# EAGLE schematic ControlModule (EAGLE 9.1.3)
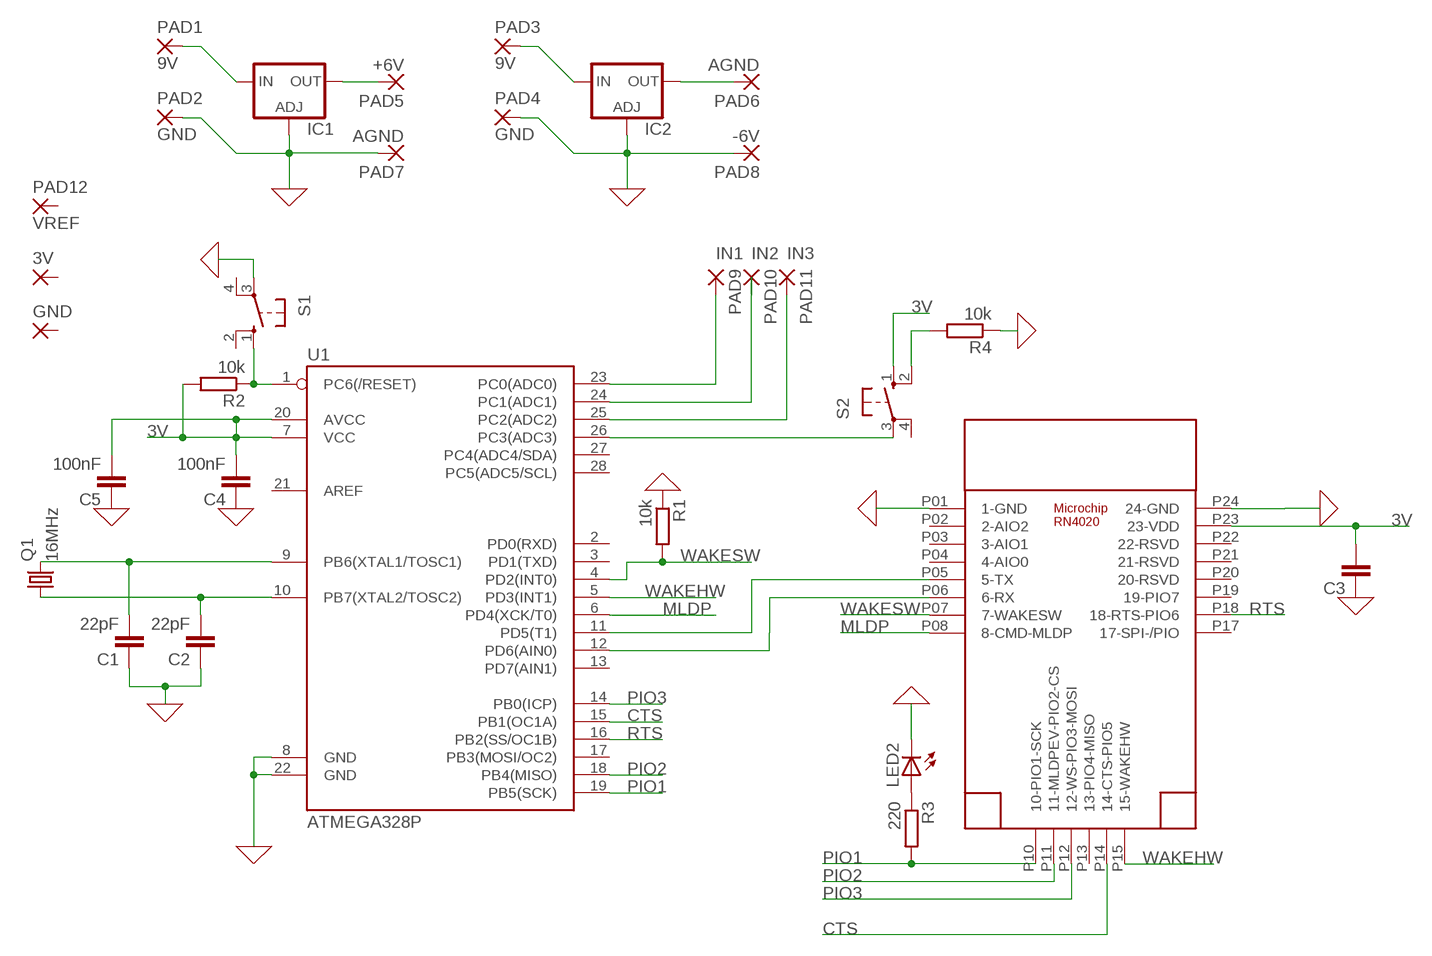
[diagram p0: schematic, sheet 1]

## Parts
3V  2,54/1,1  [2,54/1,1]
C1  22pF  C-EUC0603  [C0603]
C2  22pF  C-EUC0603  [C0603]
C3  C-EUC0603  [C0603]
C4  100nF  C-EUC0603  [C0603]
C5  100nF  C-EUC0603  [C0603]
GND  2,54/1,1  [2,54/1,1]
IC1  LM138-TL  [TO220L1]
IC2  LM138-TL  [TO220L1]
LED2  LEDCHIPLED_0603  [CHIPLED_0603]
PAD1  9V  2,54/1,1  [2,54/1,1]
PAD2  GND  2,54/1,1  [2,54/1,1]
PAD3  9V  2,54/1,1  [2,54/1,1]
PAD4  GND  2,54/1,1  [2,54/1,1]
PAD5  +6V  2,54/1,1  [2,54/1,1]
PAD6  AGND  2,54/1,1  [2,54/1,1]
PAD7  AGND  2,54/1,1  [2,54/1,1]
PAD8  -6V  2,54/1,1  [2,54/1,1]
PAD9  2,54/1,1  [2,54/1,1]
PAD10  2,54/1,1  [2,54/1,1]
PAD11  2,54/1,1  [2,54/1,1]
PAD12  VREF  2,54/1,1  [2,54/1,1]
Q1  16MHz  CRYSTALHC49S  [HC49/S]
R1  10k  R-EU_R0805  [R0805]
R2  10k  R-EU_R0805  [R0805]
R3  220  R-EU_R0805  [R0805]
R4  10k  R-EU_R0805  [R0805]
S1  10-XX  [B3F-10XX]
S2  10-XX  [B3F-10XX]
U1  ATMEGA328P  ATMEGA328P_PDIP  [DIP28]
U$1  RN4020  [RN4020SMD]

## Nets
0: C1.1 C2.1 C3.1 C4.1 C5.1 IC1.1(ADJ) IC2.1(ADJ) LED2.C PAD2.1(P) PAD4.1(P) PAD7.1(P) PAD8.1(P) R1.1 R4.1 S1.3(P) U1.8(GND) U1.22(GND) U$1.P01(1-GND) U$1.P24(24-GND) ; supply symbol labelled GND
3V: C3.2 C4.2 C5.2 R2.2 S2.1(S) U1.7(VCC) U1.20(AVCC) U$1.P23(23-VDD)
9V: IC1.3(IN) PAD1.1(P)
CTS: U1.15(PB1(OC1A)) U$1.P14(14-CTS-PIO5)
IN1: PAD9.1(P) U1.23(PC0(ADC0))
IN2: PAD10.1(P) U1.24(PC1(ADC1))
IN3: PAD11.1(P) U1.25(PC2(ADC2))
MLDP: U1.6(PD4(XCK/T0)) U$1.P08(8-CMD-MLDP)
N$1: U1.12(PD6(AIN0)) U$1.P06(6-RX)
N$2: U1.11(PD5(T1)) U$1.P05(5-TX)
N$3: S2.3(P) U1.26(PC3(ADC3))
N$5: C1.2 Q1.2 U1.9(PB6(XTAL1/TOSC1))
N$6: IC2.3(IN) PAD3.1(P)
N$7: IC1.2(OUT) PAD5.1(P)
N$8: C2.2 Q1.1 U1.10(PB7(XTAL2/TOSC2))
N$9: IC2.2(OUT) PAD6.1(P)
N$10: R2.1 S1.1(S) U1.1(PC6(/RESET))
N$11: LED2.A R3.1
N$12: R4.2 S2.2(S1)
PIO1: R3.2 U1.19(PB5(SCK)) U$1.P10(10-PIO1-SCK)
PIO2: U1.18(PB4(MISO)) U$1.P11(11-MLDPEV-PIO2-CS)
PIO3: U1.14(PB0(ICP)) U$1.P12(12-WS-PIO3-MOSI)
RTS: U1.16(PB2(SS/OC1B)) U$1.P18(18-RTS-PIO6)
WAKEHW: U1.5(PD3(INT1)) U$1.P15(15-WAKEHW)
WAKESW: R1.2 U1.4(PD2(INT0)) U$1.P07(7-WAKESW)
Unconnected: 3V.1(P) GND.1(P) PAD12.1(P) S1.2(S1) S1.4(P1) S2.4(P1) U1.2(PD0(RXD)) U1.3(PD1(TXD)) U1.13(PD7(AIN1)) U1.17(PB3(MOSI/OC2)) U1.21(AREF) U1.27(PC4(ADC4/SDA)) U1.28(PC5(ADC5/SCL)) U$1.P02(2-AIO2) U$1.P03(3-AIO1) U$1.P04(4-AIO0) U$1.P13(13-PIO4-MISO) U$1.P17(17-SPI-/PIO) U$1.P19(19-PIO7) U$1.P20(20-RSVD) U$1.P21(21-RSVD) U$1.P22(22-RSVD)

## Library data of the parts
3V GND PAD1-PAD12 = wirepad:2,54/1,1: THROUGH-HOLE PAD
C1-C5 = rcl:C-EU: CAPACITOR, European symbol; SPICEPREFIX: C
IC1 IC2 = v-reg:LM138-TL: VOLTAGE REGULATOR
LED2 = led:LED: LED OSRAM: - CHIPLED LG R971, LG N971, LY N971, LG Q971, LY Q971, LO R971, LY R971 LH N974, LH R974 LS Q976, LO Q976, LY Q976 LO Q996 - Hyper CHIPLED LW Q18S LB Q993, LB Q99A, LB R99A - SideLED LS A670, LO A670, LY A670, LG A670, LP A670 LB A673, LV A673, LT A673, LW A673 LH A674 LY A675 LS A676, LA A676, LO A676, LY A676, LW A676 LS A679, LY A679, LG A679 - Hyper Micro SIDELED® LS Y876, LA Y876, LO Y876, LY Y876 LT Y87S - SmartLED LW L88C, LW L88S LB L89C, LB L89S, LG L890 LS L89K, LO L89K, LY L89K LS L896, LA L896, LO L896, LY L896 - TOPLED LS T670, LO T670, LY T670, LG T670, LP T670 LSG T670, LSP T670, LSY T670, LOP T670, LYG T670 LG T671, LOG T671, LSG T671 LB T673, LV T673, LT T673, LW T673 LH T674 LS T676, LA T676, LO T676, LY T676, LB T676, LH T676, LSB T676, LW T676 LB T67C, LV T67C, LT T67C, LS T67K, LO T67K, LY T67K, LW E67C LS E67B, LA E67B, LO E67B, LY E67B, LB E67C, LV E67C, LT E67C LW T67C LS T679, LY T679, LG T679 LS T770, LO T770, LY T770, LG T770, LP T770 LB T773, LV T773, LT T773, LW T773 LH T774 LS E675, LA E675, LY E675, LS T675 LS T776, LA T776, LO T776, LY T776, LB T776 LHGB T686 LT T68C, LB T68C - Hyper Mini TOPLED® LB M676 - Mini TOPLED Santana® LG M470 LS M47K, LO M47K, LY M47K Source: http://www.osram.convergy.de LUXEON: - LUMILED® LXK2-PW12-R00, LXK2-PW12-S00, LXK2-PW14-U00, LXK2-PW14-V00 LXK2-PM12-R00, LXK2-PM12-S00, LXK2-PM14-U00 LXK2-PE12-Q00, LXK2-PE12-R00, LXK2-PE12-S00, LXK2-PE14-T00, LXK2-PE14-U00 LXK2-PB12-K00, LXK2-PB12-L00, LXK2-PB12-M00, LXK2-PB14-N00, LXK2-PB14-P00, LXK2-PB14-Q00 LXK2-PR12-L00, LXK2-PR12-M00, LXK2-PR14-Q00, LXK2-PR14-R00 LXK2-PD12-Q00, LXK2-PD12-R00, LXK2-PD12-S00 LXK2-PH12-R00, LXK2-PH12-S00 LXK2-PL12-P00, LXK2-PL12-Q00, LXK2-PL12-R00 Source: www.luxeon.com KINGBRIGHT: KA-3528ASYC Source: www.kingbright.com
Q1 = crystal:CRYSTAL: CRYSTAL; OC_FARNELL: 1667008; OC_NEWARK: unknown
R1-R4 = rcl:R-EU_: RESISTOR, European symbol; SPICEPREFIX: R
S1 S2 = switch-omron:10-XX: OMRON SWITCH; MPN: B3F-1000; OC_FARNELL: 176432; OC_NEWARK: 36M3542
U1 = SparkFun-IC-Microcontroller:ATMEGA328P_PDIP: Atmel 328P Through hole ATMEGA328P uC used in the Arduino 32kb flash, 1k EEPROM, 2k SRAM Datasheet <http://www.sparkfun.com/datasheets/Components/SMD/ATMega328.pdf> SparkFun Products Storefront component: AVR 28 Pin 20MHz 32K 6A/D - ATMega328P <https://www.sparkfun.com/products/9061> (COM-09061) SparkFun Simon Says - Through-Hole Soldering Kit <https://www.sparkfun.com/products/10547> (KIT-10547) SparkFun Learn to Solder - Simon Says <https://www.sparkfun.com/products/13708> (KIT-13708) SparkFun BigTime Watch Kit <https://www.sparkfun.com/products/11734> (KIT-11734) SparkFun ClockIt <https://www.sparkfun.com/products/10930> (KIT-10930) SparkFun Serial Enabled LCD Kit <https://www.sparkfun.com/products/10097> (LCD-10097) SparkFun Simon Tilts - Through Hole Soldering Kit <https://www.sparkfun.com/products/12634> (KIT-12634) SparkFun Frequency Counter Kit <https://www.sparkfun.com/products/10140> (KIT-10140) FabFM Radio Kit <https://www.sparkfun.com/products/11043> (KIT-11043) SparkFun Binary Blaster Kit <https://www.sparkfun.com/products/12037> (KIT-12037) SparkFun Metro-Gnome <https://www.sparkfun.com/products/9236> (KIT-09236) ATmega328 with Arduino Optiboot (Uno) <https://www.sparkfun.com/products/10524> (DEV-10524); PROD_ID: IC-09136; VALUE: 328P
U$1 = microchip_bluetooth_v101:RN4020